# EAGLE design PCB (EAGLE 9.2.0)
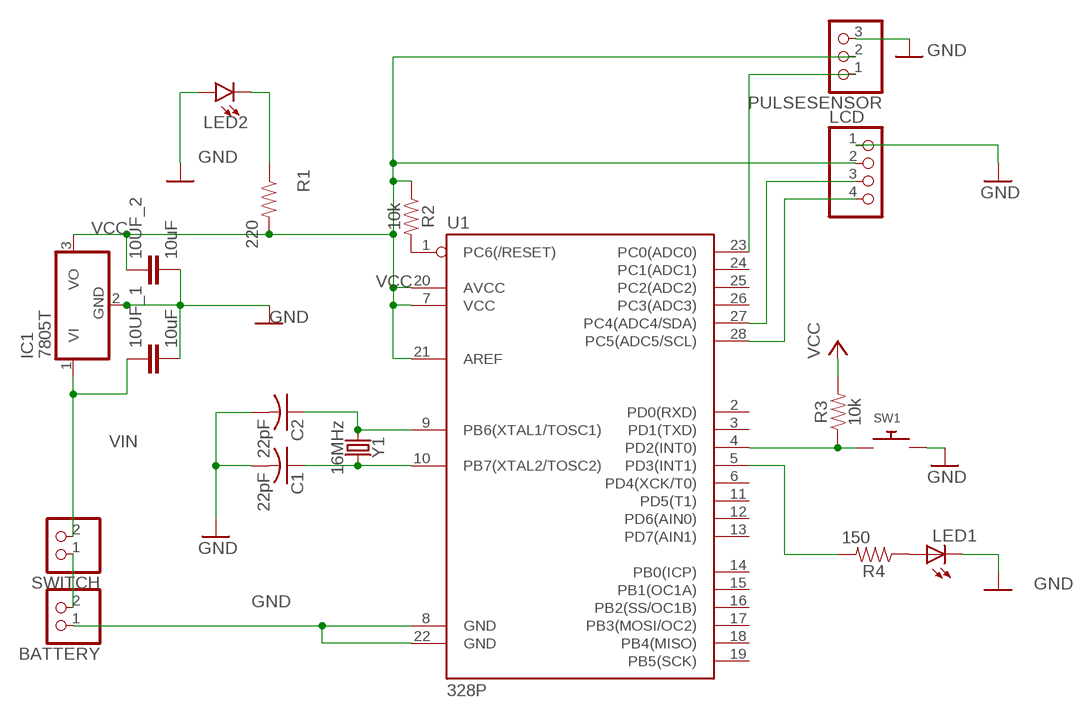
[diagram p0: schematic, sheet 1]

## Parts
10UF_1  10uF  22PF-PTH-2.54MM-200V-5%  [CAP-PTH-2.54]
10UF_2  10uF  22PF-PTH-2.54MM-200V-5%  [CAP-PTH-2.54]
BATTERY  PINHD-1X2  [1X02]
C1  22pF  C-US025-024X044  [C025-024X044]
C2  22pF  C-US025-024X044  [C025-024X044]
IC1  7805T  [TO220H]
LCD  PINHD-1X4  [1X04]
LED1  LED5MM  [LED5MM]
LED2  LED3MM  [LED_3MM]
PULSESENSOR  PINHD-1X3  [1X03]
R1  220  10KOHM-HORIZ-1/4W-5%  [AXIAL-0.3]
R2  10k  10KOHM-HORIZ-1/4W-5%  [AXIAL-0.3]
R3  10k  10KOHM-HORIZ-1/4W-5%  [AXIAL-0.3]
R4  150  10KOHM-HORIZ-1/4W-5%  [AXIAL-0.3]
SW1  SWITCH_PUSHBUTTONEVQ-PE  [TACT_PANA-EVQ]
SWITCH  PINHD-1X2  [1X02]
U1  328P  ATMEGA328P_PDIP  [DIP28]
Y1  16MHz  CRYSTAL-16MHZPTH-HC49US  [HC49US]

## Nets
GND: 10UF_1.2 10UF_2.2 BATTERY.1 C1.2 C2.2 IC1.2(GND) LCD.1 LED1.K(C) LED2.A PULSESENSOR.3 SW1.P$2 U1.8(GND) U1.22(GND)
N$1: BATTERY.2 SWITCH.1
N$3: LED1.A R4.P$1
N$4: LED2.K(C) R1.P$1
PC0/ADC0: PULSESENSOR.1 U1.23(PC0(ADC0))
PD2: R4.P$2 U1.5(PD3(INT1))
PD3: R3.P$1 SW1.P$1 U1.4(PD2(INT0))
RESET: R2.P$2 U1.1(PC6(/RESET))
SCL: LCD.4 U1.28(PC5(ADC5/SCL))
SDA: LCD.3 U1.27(PC4(ADC4/SDA))
VCC: 10UF_2.1 IC1.3(VO) LCD.2 PULSESENSOR.2 R1.P$2 R2.P$1 R3.P$2 U1.7(VCC) U1.20(AVCC) U1.21(AREF)
VIN: 10UF_1.1 IC1.1(VI) SWITCH.2
XTAL1: C2.1 U1.9(PB6(XTAL1/TOSC1)) Y1.1
XTAL2: C1.1 U1.10(PB7(XTAL2/TOSC2)) Y1.2
Unconnected: U1.2(PD0(RXD)) U1.3(PD1(TXD)) U1.6(PD4(XCK/T0)) U1.11(PD5(T1)) U1.12(PD6(AIN0)) U1.13(PD7(AIN1)) U1.14(PB0(ICP)) U1.15(PB1(OC1A)) U1.16(PB2(SS/OC1B)) U1.17(PB3(MOSI/OC2)) U1.18(PB4(MISO)) U1.19(PB5(SCK)) U1.24(PC1(ADC1)) U1.25(PC2(ADC2)) U1.26(PC3(ADC3))

## Library data of the parts
10UF_1 10UF_2 = SparkFun-Capacitors:22PF: 22pF ceramic capacitors A capacitor is a passive two-terminal electrical component used to store electrical energy temporarily in an electric field.; PROD_ID: CAP-09128; VALUE: 22pF
BATTERY SWITCH = pinhead:PINHD-1X2: PIN HEADER
C1 C2 = adafruit:C-US: CAPACITOR, American symbol
IC1 = adafruit:78*: Positive VOLTAGE REGULATOR Added bigger pads to the TO-92 package
LCD = pinhead:PINHD-1X4: PIN HEADER
LED1 = adafruit:LED: LED OSRAM: - CHIPLED LG R971, LG N971, LY N971, LG Q971, LY Q971, LO R971, LY R971 LH N974, LH R974 LS Q976, LO Q976, LY Q976 LO Q996 - Hyper CHIPLED LW Q18S LB Q993, LB Q99A, LB R99A - SideLED LS A670, LO A670, LY A670, LG A670, LP A670 LB A673, LV A673, LT A673, LW A673 LH A674 LY A675 LS A676, LA A676, LO A676, LY A676, LW A676 LS A679, LY A679, LG A679 - Hyper Micro SIDELED® LS Y876, LA Y876, LO Y876, LY Y876 LT Y87S - SmartLED LW L88C, LW L88S LB L89C, LB L89S, LG L890 LS L89K, LO L89K, LY L89K LS L896, LA L896, LO L896, LY L896 - TOPLED LS T670, LO T670, LY T670, LG T670, LP T670 LSG T670, LSP T670, LSY T670, LOP T670, LYG T670 LG T671, LOG T671, LSG T671 LB T673, LV T673, LT T673, LW T673 LH T674 LS T676, LA T676, LO T676, LY T676, LB T676, LH T676, LSB T676, LW T676 LB T67C, LV T67C, LT T67C, LS T67K, LO T67K, LY T67K, LW E67C LS E67B, LA E67B, LO E67B, LY E67B, LB E67C, LV E67C, LT E67C LW T67C LS T679, LY T679, LG T679 LS T770, LO T770, LY T770, LG T770, LP T770 LB T773, LV T773, LT T773, LW T773 LH T774 LS E675, LA E675, LY E675, LS T675 LS T776, LA T776, LO T776, LY T776, LB T776 LHGB T686 LT T68C, LB T68C - Hyper Mini TOPLED® LB M676 - Mini TOPLED Santana® LG M470 LS M47K, LO M47K, LY M47K Source: http://www.osram.convergy.de/
LED2 = SparkFun-LED:LED: LED (Generic) Standard schematic elements and footprints for 5mm, 3mm, 1206, and 0603 sized LEDs. Generic LEDs with no color specified.; PROD_ID: DIO-08794
PULSESENSOR = adafruit:PINHD-1X3: PIN HEADER
R1 R4 = SparkFun-Resistors:10KOHM: 10kΩ resistor A resistor is a passive two-terminal electrical component that implements electrical resistance as a circuit element. Resistors act to reduce current flow, and, at the same time, act to lower voltage levels within circuits. - Wikipedia; PROD_ID: RES-09435; VALUE: 10k
R2 R3 = SparkFun-Resistors:10KOHM: 10kΩ resistor A resistor is a passive two-terminal electrical component that implements electrical resistance as a circuit element. Resistors act to reduce current flow, and, at the same time, act to lower voltage levels within circuits. - Wikipedia; PROD_ID: RES-09435
SW1 = adafruit:SWITCH_PUSHBUTTON: Buttons SOFTTOUCHSMD_SJ - Soft touch temporary push button (Super Junk Akihabara) Compatible with SKPMANE010 [Mouser: 688-SKPMAN] C&K_KSS = Digikey: KSS221GLFS
U1 = SparkFun-IC-Microcontroller:ATMEGA328P_PDIP: Atmel 328P Through hole ATMEGA328P uC used in the Arduino 32kb flash, 1k EEPROM, 2k SRAM Datasheet <http://www.sparkfun.com/datasheets/Components/SMD/ATMega328.pdf> SparkFun Products Storefront component: AVR 28 Pin 20MHz 32K 6A/D - ATMega328P <https://www.sparkfun.com/products/9061> (COM-09061) SparkFun Simon Says - Through-Hole Soldering Kit <https://www.sparkfun.com/products/10547> (KIT-10547) SparkFun Learn to Solder - Simon Says <https://www.sparkfun.com/products/13708> (KIT-13708) SparkFun BigTime Watch Kit <https://www.sparkfun.com/products/11734> (KIT-11734) SparkFun ClockIt <https://www.sparkfun.com/products/10930> (KIT-10930) SparkFun Serial Enabled LCD Kit <https://www.sparkfun.com/products/10097> (LCD-10097) SparkFun Simon Tilts - Through Hole Soldering Kit <https://www.sparkfun.com/products/12634> (KIT-12634) SparkFun Frequency Counter Kit <https://www.sparkfun.com/products/10140> (KIT-10140) FabFM Radio Kit <https://www.sparkfun.com/products/11043> (KIT-11043) SparkFun Binary Blaster Kit <https://www.sparkfun.com/products/12037> (KIT-12037) SparkFun Metro-Gnome <https://www.sparkfun.com/products/9236> (KIT-09236) ATmega328 with Arduino Optiboot (Uno) <https://www.sparkfun.com/products/10524> (DEV-10524); PROD_ID: IC-09136
Y1 = SparkFun-Clocks:CRYSTAL-16MHZ: 16MHz Crystal Digikey Example <http://www.digikey.com/product-search/en?keywords=535-9122-1-ND> Frequency: 16MHz Frequency Stability: ±50ppm Frequency Tolerance: ±20ppm Load Capacitance: 18pF SparkFun Products: Pro Micro -5V/16MHz <https://www.sparkfun.com/products/12640> SparkFun Serial Enabled LCD Kit <https://www.sparkfun.com/products/10097>; PROD_ID: XTAL-08181; SF_ID: COM-00536

## Board
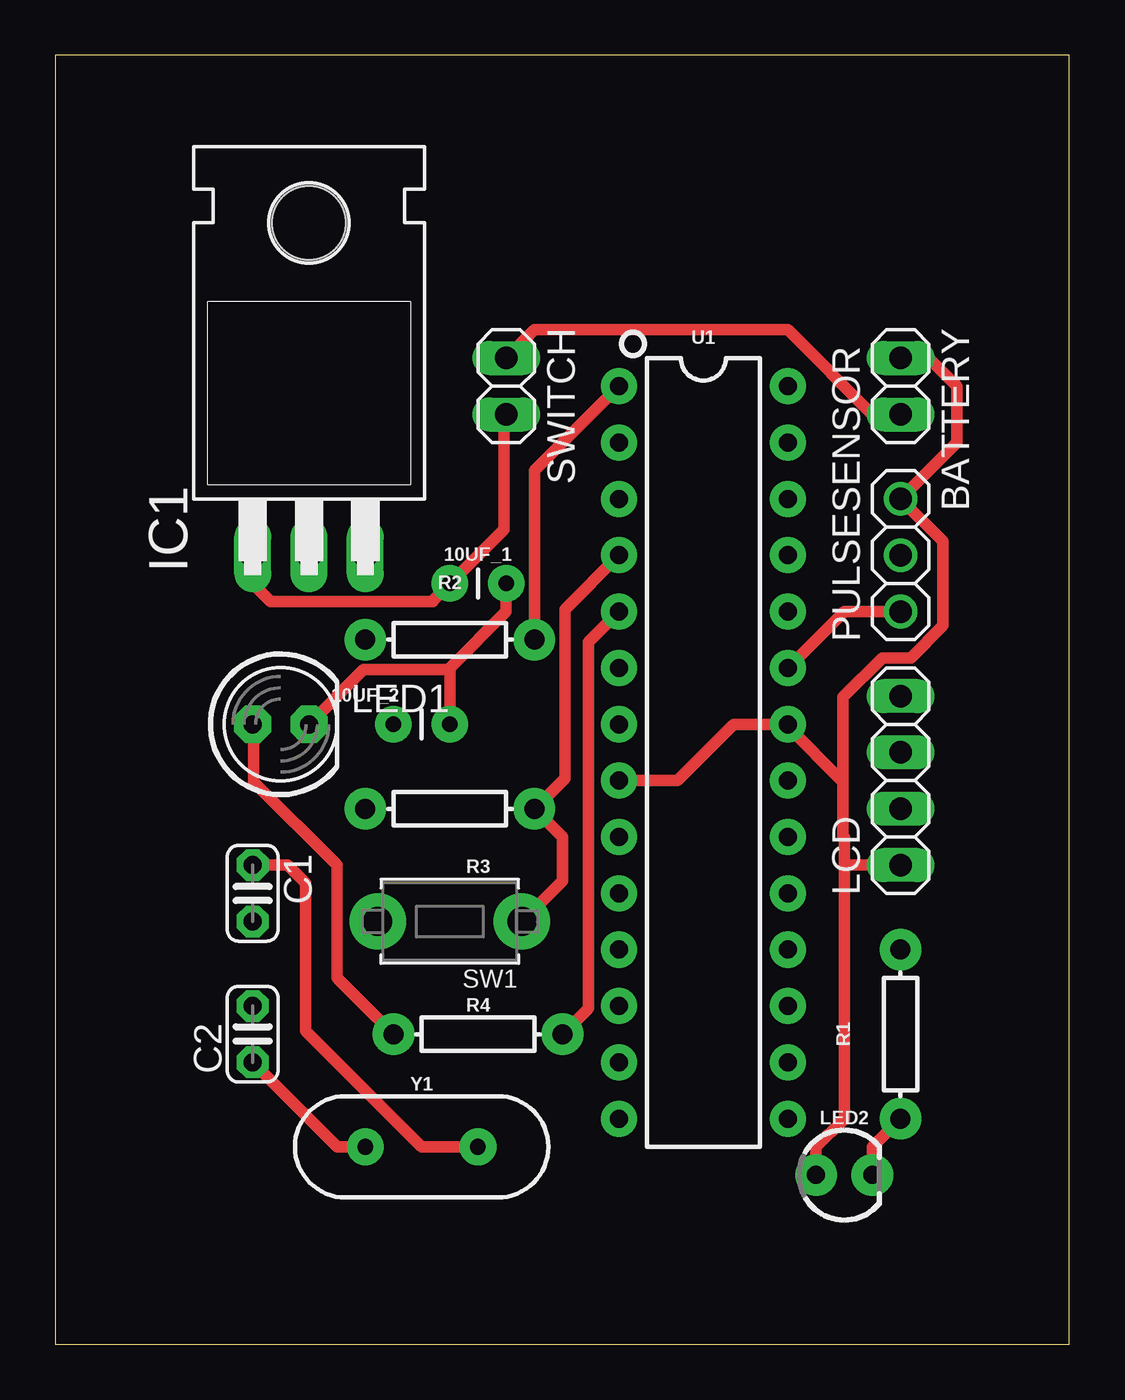
[diagram p1: board, top side]
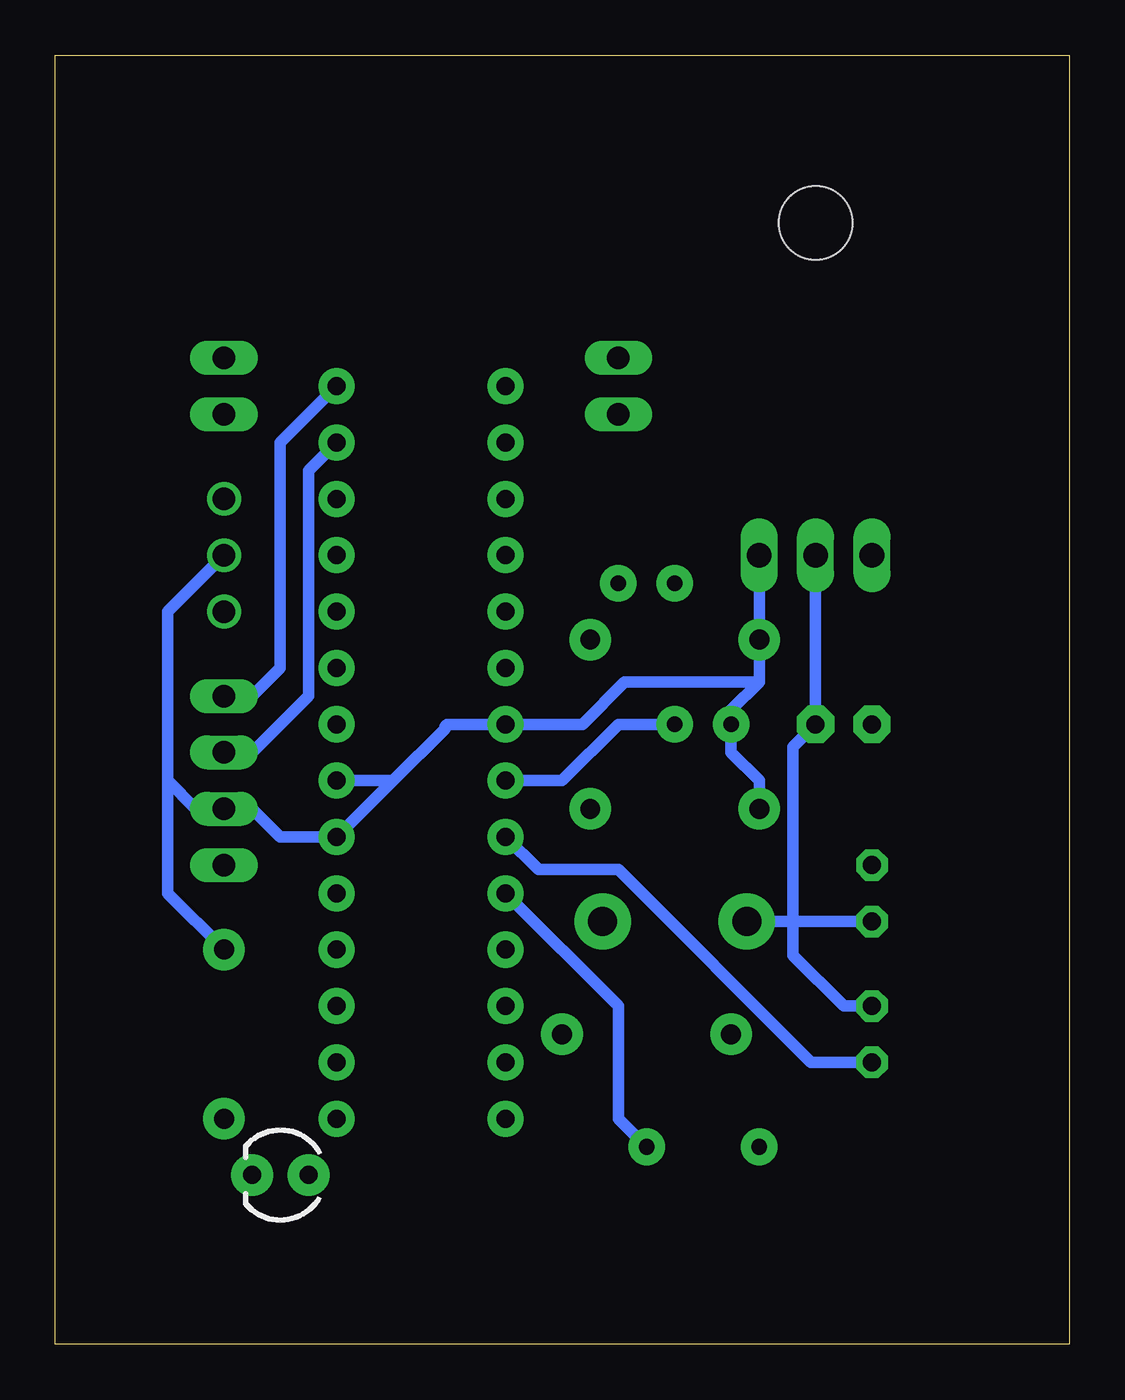
[diagram p2: board, bottom side, seen from below]

Size 45.7 x 58.09 mm. Coordinates in mm from the lower left corner, seen from the top.
Outline: 0,0 45.7,0 45.7,58.09 0,58.09 0,0
Copper layers (1*16): Top 0.035mm / dielectric 1.5mm / Bottom 0.035mm
Design rules "default": minimum track width 6mil, minimum drill 0.35mm, track to track 6mil, track to pad 6mil, pad to pad 6mil, via to via 6mil, smd to smd 6mil, copper to edge 40mil, drill to drill 6mil, minimum pad ring 10mil, minimum via ring 8mil, stop-mask expansion 4mil, vias tented up to drill 0mil, thermal gap 10mil

### Footprints (pad centres in the part's own frame; a part is rotated, then mirrored left to right if it is on the bottom)
CAP-PTH-2.54 = drill 0.7 pad 1.651: 1 -1.27,0; 2 1.27,0
1X02 = drill 1.016 long: 1 -1.27,0; 2 1.27,0
C025-024X044 = drill 0.813 pad 1.422 octagon: 1 -1.27,0; 2 1.27,0
TO220H = drill 1.118 long: 1 -2.54,-10.16; 2 0,-10.16; 3 2.54,-10.16 | hole 3.302: 0,4.826
1X04 = drill 1.016 long: 1 -3.81,0; 2 -1.27,0; 3 1.27,0; 4 3.81,0
LED5MM = drill 0.813 pad 1.676 octagon: A -1.27,0; K 1.27,0
LED_3MM = drill 0.813 pad 1.88: A -1.27,0; K 1.27,0
1X03 = drill 1.016: 1 -2.54,0; 2 0,0; 3 2.54,0
AXIAL-0.3 = drill 0.9 pad 1.88: P$1 -3.81,0; P$2 3.81,0
TACT_PANA-EVQ = drill 1.3 pad 2.54: P$1 -3.25,0; P$2 3.25,0
DIP28 = drill 0.813 pad 1.626: 1 -16.51,-3.81; 2 -13.97,-3.81; 3 -11.43,-3.81; 4 -8.89,-3.81; 5 -6.35,-3.81; 6 -3.81,-3.81; 7 -1.27,-3.81; 8 1.27,-3.81; 9 3.81,-3.81; 10 6.35,-3.81; 11 8.89,-3.81; 12 11.43,-3.81; 13 13.97,-3.81; 14 16.51,-3.81; 15 16.51,3.81; 16 13.97,3.81; 17 11.43,3.81; 18 8.89,3.81; 19 6.35,3.81; 20 3.81,3.81; 21 1.27,3.81; 22 -1.27,3.81; 23 -3.81,3.81; 24 -6.35,3.81; 25 -8.89,3.81; 26 -11.43,3.81; 27 -13.97,3.81; 28 -16.51,3.81
HC49US = drill 0.7 pad 1.651: 1 -2.54,0; 2 2.54,0

### Placement (x,y rotation side)
10UF_1  19.05,34.29 0 top
10UF_2  16.51,27.94 0 top
BATTERY  38.1,43.18 270 top
C1  8.89,20.32 270 top
C2  8.89,13.97 90 top
IC1  11.43,45.72 0 top
LCD  38.1,25.4 90 top
LED1  10.16,27.94 0 top
LED2  35.56,7.62 0 top
PULSESENSOR  38.1,35.56 90 top
R1  38.1,13.97 90 top
R2  17.78,31.75 0 top
R3  17.78,24.13 180 top
R4  19.05,13.97 0 top
SW1  17.78,19.05 180 top
SWITCH  20.32,43.18 270 top
U1  29.21,26.67 270 top
Y1  16.51,8.89 0 top

### Tracks (layer width: path | path; a pad name or v marks a point on that pad's centre or on a via)
GND
  Top 0.152: 38.2,38.2 PULSESENSOR.3 38.2,38.05 | 30.48,27.84 33.02,27.84 U1.22
  Top 0.508: BATTERY.1 39.37,44.45 40.64,43.18 40.64,40.64 38.2,38.2 | PULSESENSOR.3 40.01,36.2 40.01,32.38 38.56,30.94 37.29,30.94 35.51,29.16 35.51,25.35 | LED2.A 34.29,8.89 35.56,10.16 35.56,21.59 | 35.56,21.59 35.56,22.86 35.51,22.91 35.51,25.35 | 35.51,25.35 33.02,27.84 | U1.22 30.58,27.94 30.48,27.84 28.04,25.4 U1.8 | 17.78,30.4 17.78,30.48 20.32,33.02 10UF_1.2 | 17.78,30.4 10UF_2.2 | LED1.K 13.89,30.4 17.78,30.4 | LCD.1 35.56,21.59
  Bottom 0.152: C1.2 8.99,19.15 12.45,19.15 14.53,19.15 SW1.P$2
  Bottom 0.508: 10UF_2.2 20.32,27.94 22.86,25.4 U1.8 | SW1.P$2 C1.2 | IC1.2 LED1.K 12.45,26.92 12.45,19.15 12.45,17.53 10.16,15.24 C2.2
N$1
  Top 0.508: SWITCH.1 21.59,45.72 33.02,45.72 36.83,41.91 BATTERY.2
N$3
  Top 0.508: R4.P$1 12.7,16.51 12.7,21.59 8.94,25.35 8.94,27.89 LED1.A
N$4
  Top 0.508: LED2.K 36.83,8.89 R1.P$1
PC0/ADC0
  Top 0.508: PULSESENSOR.1 35.56,33.02 U1.23
PD2
  Top 0.508: U1.5 24.03,31.65 24.03,15.14 R4.P$2
PD3
  Top 0.508: U1.4 22.96,33.12 22.96,25.5 R3.P$1 22.86,22.86 22.86,20.88 SW1.P$1
RESET
  Top 0.508: R2.P$2 21.59,39.37 U1.1
SCL
  Bottom 0.508: U1.28 35.56,40.64 35.56,30.48 36.83,29.21 LCD.4
SDA
  Bottom 0.508: U1.27 34.29,39.37 34.29,30.84 34.29,30.48 | LCD.3 36.83,26.67 34.29,29.21 34.29,30.48 | 34.29,30.48
VCC
  Bottom 0.152: IC1.3 13.97,34.7 | 38.2,35.46 PULSESENSOR.2 | 38.2,17.78 R1.P$2
  Bottom 0.508: 13.97,29.84 15.24,28.57 10UF_2.1 15.24,26.67 13.97,25.4 R3.P$2 | 13.97,29.84 IC1.3 R2.P$1 | 13.97,29.84 20.04,29.84 21.95,27.94 U1.7 28.04,27.94 28.14,27.84 28.14,27.74 30.48,25.4 | 38.2,35.46 40.64,33.02 40.64,25.4 | 40.64,25.4 39.37,24.13 LCD.2 36.83,24.13 35.56,22.86 U1.20 30.48,25.4 | 40.64,25.4 40.64,20.32 R1.P$2 | U1.21 30.48,25.4
VIN
  Top 0.152: 20.22,41.86 SWITCH.2
  Top 0.508: IC1.1 8.89,34.29 9.7,33.48 17.02,33.48 17.02,33.53 10UF_1.1 20.22,36.73 20.22,41.86
XTAL1
  Top 0.508: Y1.1 12.7,8.89 C2.1
  Bottom 0.508: C2.1 11.63,12.7 20.32,21.39 23.93,21.39 U1.9
XTAL2
  Top 0.508: Y1.2 16.51,8.89 11.28,14.12 11.28,20.78 10.47,21.59 C1.1
  Bottom 0.508: Y1.2 20.32,10.16 20.32,15.24 U1.10